# EAGLE design eight-button-sheild (EAGLE 8.7.1)
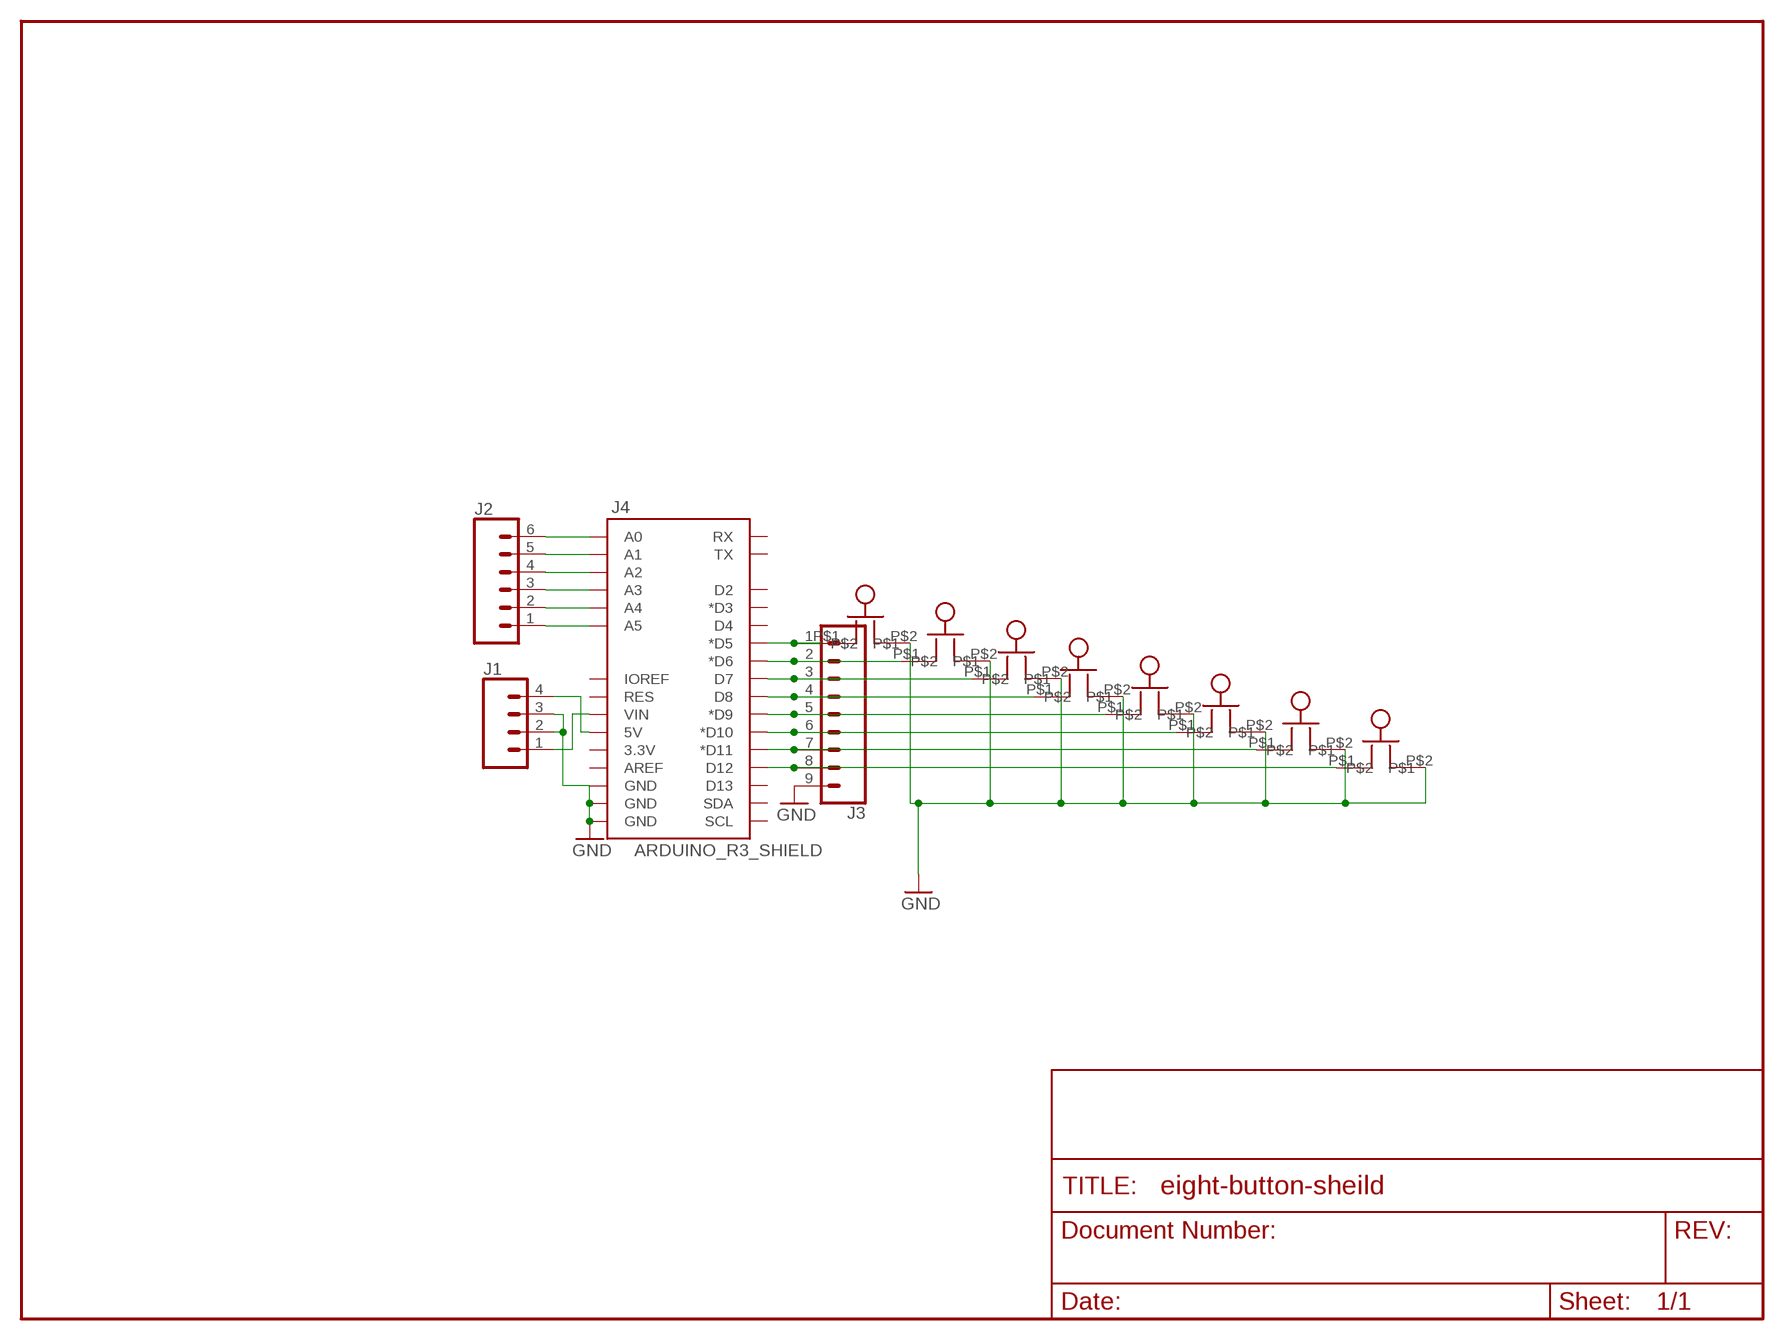
[diagram p0: schematic, sheet 1]

## Parts
J1  CONN_04  [1X04]
J2  CONN_06SILK_FEMALE_PTH  [1X06]
J3  CONN_09  [1X09]
J4  ARDUINO_R3_SHIELD  [UNO_R3_SHIELD]
SW1  BUTTON  [BUTTON]
SW2  BUTTON  [BUTTON]
SW3  BUTTON  [BUTTON]
SW4  BUTTON  [BUTTON]
SW5  BUTTON  [BUTTON]
SW6  BUTTON  [BUTTON]
SW7  BUTTON  [BUTTON]
SW8  BUTTON  [BUTTON]

## Nets
GND: J1.2 J1.3 J3.9 J4.GND@0(GND) J4.GND@1(GND) J4.GND@2(GND) SW1.P$2 SW2.P$2 SW3.P$2 SW4.P$2 SW5.P$2 SW6.P$2 SW7.P$2 SW8.P$2
N$1: J3.1 J4.D5(*D5) SW1.P$1
N$4: J3.2 J4.D6(*D6) SW2.P$1
N$5: J3.3 J4.D7 SW3.P$1
N$6: J3.4 J4.D8 SW4.P$1
N$7: J3.5 J4.D9(*D9) SW5.P$1
N$8: J3.6 J4.D10(*D10) SW6.P$1
N$9: J2.1 J4.A5
N$10: J3.7 J4.D11(*D11) SW7.P$1
N$11: J3.8 J4.D12 SW8.P$1
N$12: J2.2 J4.A4
N$13: J2.3 J4.A3
N$14: J2.4 J4.A2
N$15: J2.5 J4.A1
N$16: J2.6 J4.A0
N$17: J1.1 J4.VIN
N$18: J1.4 J4.5V
Unconnected: J4.3.3V J4.AREF J4.D2 J4.D3(*D3) J4.D4 J4.D13 J4.IOREF J4.RES J4.RX J4.SCL J4.SDA J4.TX

## Library data of the parts
J1 = SparkFun-Connectors:CONN_04: Multi connection point. Often used as Generic Header-pin footprint for 0.1 inch spaced/style header connections On any of the 0.1 inch spaced packages, you can populate with these: Break Away Headers - Straight <https://www.sparkfun.com/products/116> (PRT-00116) Break Away Male Headers - Right Angle <https://www.sparkfun.com/products/553> (PRT-00553) Female Headers <https://www.sparkfun.com/products/115> (PRT-00115) Break Away Headers - Machine Pin <https://www.sparkfun.com/products/117> (PRT-00117) Break Away Female Headers - Swiss Machine Pin <https://www.sparkfun.com/products/743> (PRT-00743) For SCREWTERMINALS and SPRING TERMINALS visit here: Screw Terimnals on SparkFun.com <https://www.sparkfun.com/search/results?term=Screw+Terminals> (5mm/3.5mm/2.54mm spacing) This device is also useful as a general connection point to wire up your design to another part of your project. Our various solder wires solder well into these plated through hole pads. Hook-Up Wire - Assortment (Stranded, 22 AWG) <https://www.sparkfun.com/products/11375> (PRT-11375) Hook-Up Wire - Assortment (Solid Core, 22 AWG) <https://www.sparkfun.com/products/11367> (PRT-11367) View the entire wire category on our website here <https://www.sparkfun.com/categories/141> Special notes: Molex polarized connector foot print use with SKU : PRT-08231 with associated crimp pins and housings. 1MM SMD Version SKU: PRT-10208; PROD_ID: CONN-09696
J2 = SparkFun-Connectors:CONN_06: Multi connection point. Often used as Generic Header-pin footprint for 0.1 inch spaced/style header connections On any of the 0.1 inch spaced packages, you can populate with these: Break Away Headers - Straight <https://www.sparkfun.com/products/116> (PRT-00116) Break Away Male Headers - Right Angle <https://www.sparkfun.com/products/553> (PRT-00553) Female Headers <https://www.sparkfun.com/products/115> (PRT-00115) Break Away Headers - Machine Pin <https://www.sparkfun.com/products/117> (PRT-00117) Break Away Female Headers - Swiss Machine Pin <https://www.sparkfun.com/products/743> (PRT-00743) Arduino Stackable Header - 6 Pin <https://www.sparkfun.com/products/9280> (PRT-09280) For SCREWTERMINALS and SPRING TERMINALS visit here: Screw Terimnals on SparkFun.com <https://www.sparkfun.com/search/results?term=Screw+Terminals> (5mm/3.5mm/2.54mm spacing) This device is also useful as a general connection point to wire up your design to another part of your project. Our various solder wires solder well into these plated through hole pads. Hook-Up Wire - Assortment (Stranded, 22 AWG) <https://www.sparkfun.com/products/11375> (PRT-11375) Hook-Up Wire - Assortment (Solid Core, 22 AWG) <https://www.sparkfun.com/products/11367> (PRT-11367) View the entire wire category on our website here <https://www.sparkfun.com/categories/141>; PROD_ID: CONN-08437
J3 = SparkFun-Connectors:CONN_09: Multi connection point. Often used as Generic Header-pin footprint for 0.1 inch spaced/style header connections On any of the 0.1 inch spaced packages, you can populate with these: Break Away Headers - Straight <https://www.sparkfun.com/products/116> (PRT-00116) Break Away Male Headers - Right Angle <https://www.sparkfun.com/products/553> (PRT-00553) Female Headers <https://www.sparkfun.com/products/115> (PRT-00115) Break Away Headers - Machine Pin <https://www.sparkfun.com/products/117> (PRT-00117) Break Away Female Headers - Swiss Machine Pin <https://www.sparkfun.com/products/743> (PRT-00743) For SCREWTERMINALS and SPRING TERMINALS visit here: Screw Terimnals on SparkFun.com <https://www.sparkfun.com/search/results?term=Screw+Terminals> (5mm/3.5mm/2.54mm spacing) This device is also useful as a general connection point to wire up your design to another part of your project. Our various solder wires solder well into these plated through hole pads. Hook-Up Wire - Assortment (Stranded, 22 AWG) <https://www.sparkfun.com/products/11375> (PRT-11375) Hook-Up Wire - Assortment (Solid Core, 22 AWG) <https://www.sparkfun.com/products/11367> (PRT-11367) View the entire wire category on our website here <https://www.sparkfun.com/categories/141> Special notes: Molex polarized connector foot print use with SKU : PRT-08231 with associated crimp pins and housings. 1MM SMD Version SKU: PRT-10208 NOTES ON THE VARIANTS LOCK and LOCK_LONGPADS... This footprint was designed to help hold the alignment of a through-hole component (i.e. 6-pin header) while soldering it into place. You may notice that each hole has been shifted either up or down by 0.005 of an inch from it's more standard position (which is a perfectly straight line). This slight alteration caused the pins (the squares in the middle) to touch the edges of the holes. Because they are alternating, it causes a "brace" to hold the component in place. 0.005 has proven to be the perfect amount of "off-center" position when using our standard breakaway headers. Although looks a little odd when you look at the bare footprint, once you have a header in there, the alteration is very hard to notice. Also,if you push a header all the way into place, it is covered up entirely on the bottom side.
J4 = SparkFun-Boards:ARDUINO_R3_SHIELD: Shield form compatible with the Arduino Uno R3.
SW1-SW8 = spietz-library:BUTTON

## Net classes
0 default: width 0.203 mm
1 vcc: width 0.254 mm

## Board
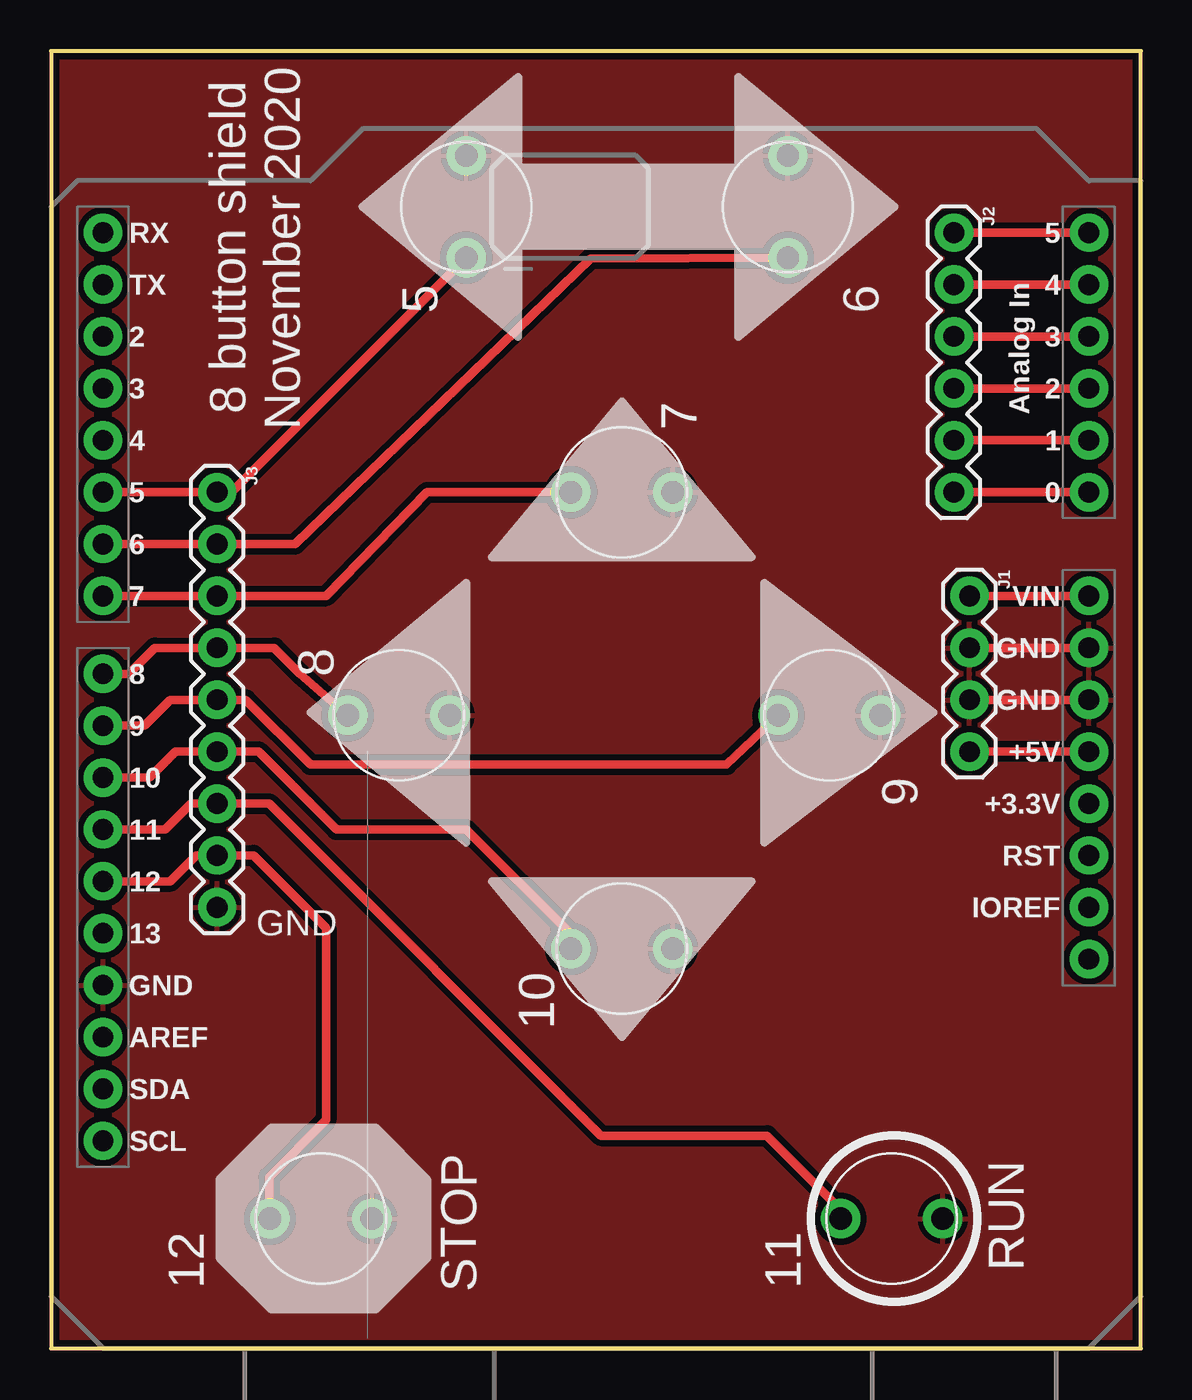
[diagram p1: board, top side]
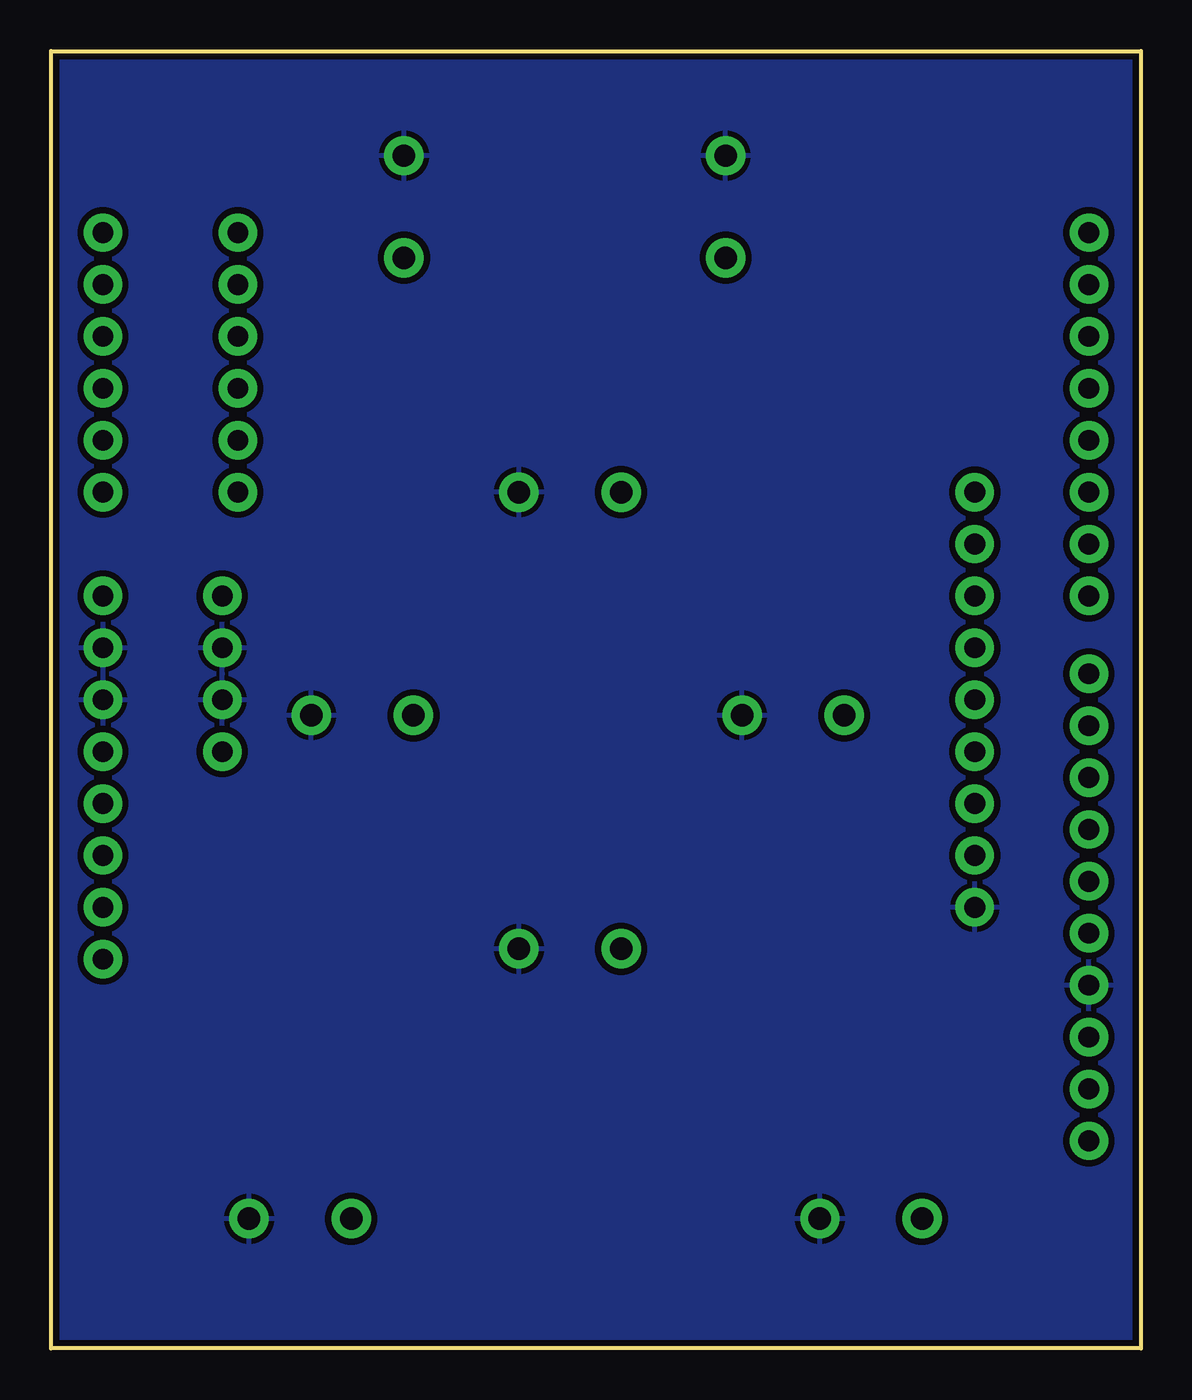
[diagram p2: board, bottom side, seen from below]

Size 53.34 x 63.5 mm. Coordinates in mm from the lower left corner, seen from the top.
Outline: 0,63.5 0,0 53.34,0 53.34,63.5 0,63.5
Copper layers (1*16): Top 0.035mm / dielectric 1.5mm / Bottom 0.035mm
Design rules "default": minimum track width 8mil, minimum drill 20mil, track to track 8mil, track to pad 8mil, pad to pad 8mil, via to via 8mil, smd to smd 8mil, copper to edge 10mil, drill to drill 8mil, minimum pad ring 12mil, minimum via ring 10mil, stop-mask expansion 4mil, vias tented up to drill 25mil, thermal gap 10mil

### Footprints (pad centres in the part's own frame; a part is rotated, then mirrored left to right if it is on the bottom)
1X04 = drill 1.016 pad 1.88: 1 0,0; 2 2.54,0; 3 5.08,0; 4 7.62,0
1X06 = drill 1.016 pad 1.88: 1 0,0; 2 2.54,0; 3 5.08,0; 4 7.62,0; 5 10.16,0; 6 12.7,0
1X09 = drill 1.016 pad 1.88: 1 0,0; 2 2.54,0; 3 5.08,0; 4 7.62,0; 5 10.16,0; 6 12.7,0; 7 15.24,0; 8 17.78,0; 9 20.32,0
UNO_R3_SHIELD = drill 1.016 pad 1.88: 3.3V 50.8,26.67; 5V 50.8,29.21; A0 50.8,41.91; A1 50.8,44.45; A2 50.8,46.99; A3 50.8,49.53; A4 50.8,52.07; A5 50.8,54.61; AREF 2.54,15.24; D2 2.54,49.53; D3 2.54,46.99; D4 2.54,44.45; D5 2.54,41.91; D6 2.54,39.37; D7 2.54,36.83; D8 2.54,33.02; D9 2.54,30.48; D10 2.54,27.94; D11 2.54,25.4; D12 2.54,22.86; D13 2.54,20.32; GND@0 50.8,31.75; GND@1 50.8,34.29; GND@2 2.54,17.78; IOREF 50.8,21.59; NC 50.8,19.05; RES 50.8,24.13; RX 2.54,54.61; SCL 2.54,10.16; SDA 2.54,12.7; TX 2.54,52.07; VIN 50.8,36.83
BUTTON = drill 1.1 pad 1.93: P$1 -2.499,0; P$2 2.499,0

### Placement (x,y rotation side)
J1  44.96,36.83 270 top
J2  44.2,54.61 270 top
J3  8.13,41.91 270 top
J4  0,0 0 top
SW1  20.32,55.88 90 top
SW2  36.07,55.88 90 top
SW3  27.94,41.91 0 top
SW4  17.02,30.99 0 top
SW5  38.1,30.99 0 top
SW6  27.94,19.56 0 top
SW7  41.15,6.35 0 top
SW8  13.21,6.35 0 top

### Tracks (layer width: path | path; a pad name or v marks a point on that pad's centre or on a via)
GND
  Top 0.406: J4.GND@1 J1.2 | J1.3 J4.GND@0
  pour Top (isolate 0.305): -2.54,65.41 54.61,65.41 54.61,-0.64 -2.54,-0.64
  pour Bottom (isolate 0.305): -3.81,67.31 55.24,67.31 55.24,-1.91 -3.81,-1.91
N$1
  Top 0.406: J4.D5 J3.1 8.85,41.91 SW1.P$1
N$4
  Top 0.406: SW2.P$1 26.42,53.34 11.94,39.37 J3.2 J4.D6
N$5
  Top 0.406: SW3.P$1 18.41,41.91 13.46,36.83 J3.3 J4.D7
N$6
  Top 0.406: SW4.P$1 12.19,33.02 10.92,34.29 J3.4 5.08,34.29 3.81,33.02 J4.D8
N$7
  Top 0.406: SW5.P$1 33.06,28.57 12.7,28.57 9.53,31.75 J3.5 5.84,31.75 4.57,30.48 J4.D9
N$8
  Top 0.406: J4.D10 4.83,27.94 6.1,29.21 J3.6 10.16,29.21 13.97,25.4 20.32,25.4 25.44,20.28 SW6.P$1
N$9
  Top 0.406: J2.1 J4.A5
N$10
  Top 0.406: J4.D11 5.59,25.4 6.86,26.67 J3.7 10.67,26.67 26.92,10.41 35.05,10.41 38.65,6.82 SW7.P$1
N$11
  Top 0.406: J4.D12 5.84,22.86 7.11,24.13 J3.8 9.91,24.13 13.46,20.57 13.46,11.18 10.67,8.38 10.67,6.39 SW8.P$1
N$12
  Top 0.406: J2.2 J4.A4
N$13
  Top 0.406: J2.3 J4.A3
N$14
  Top 0.406: J2.4 J4.A2
N$15
  Top 0.406: J4.A1 J2.5
N$16
  Top 0.406: J2.6 J4.A0
N$17
  Top 0.406: J1.1 J4.VIN
N$18
  Top 0.406: J4.5V J1.4

### Text on the board
tPlace: 8 button shield / November 2020 | 5 | 6 | 7 | 8 | 9 | GND | 10 | STOP | 12 | 11 | RUN
tValues: Tent Vias! | Arduino Wee v1.3